# Altium schematic sheet Sheet1.SchDoc
size A
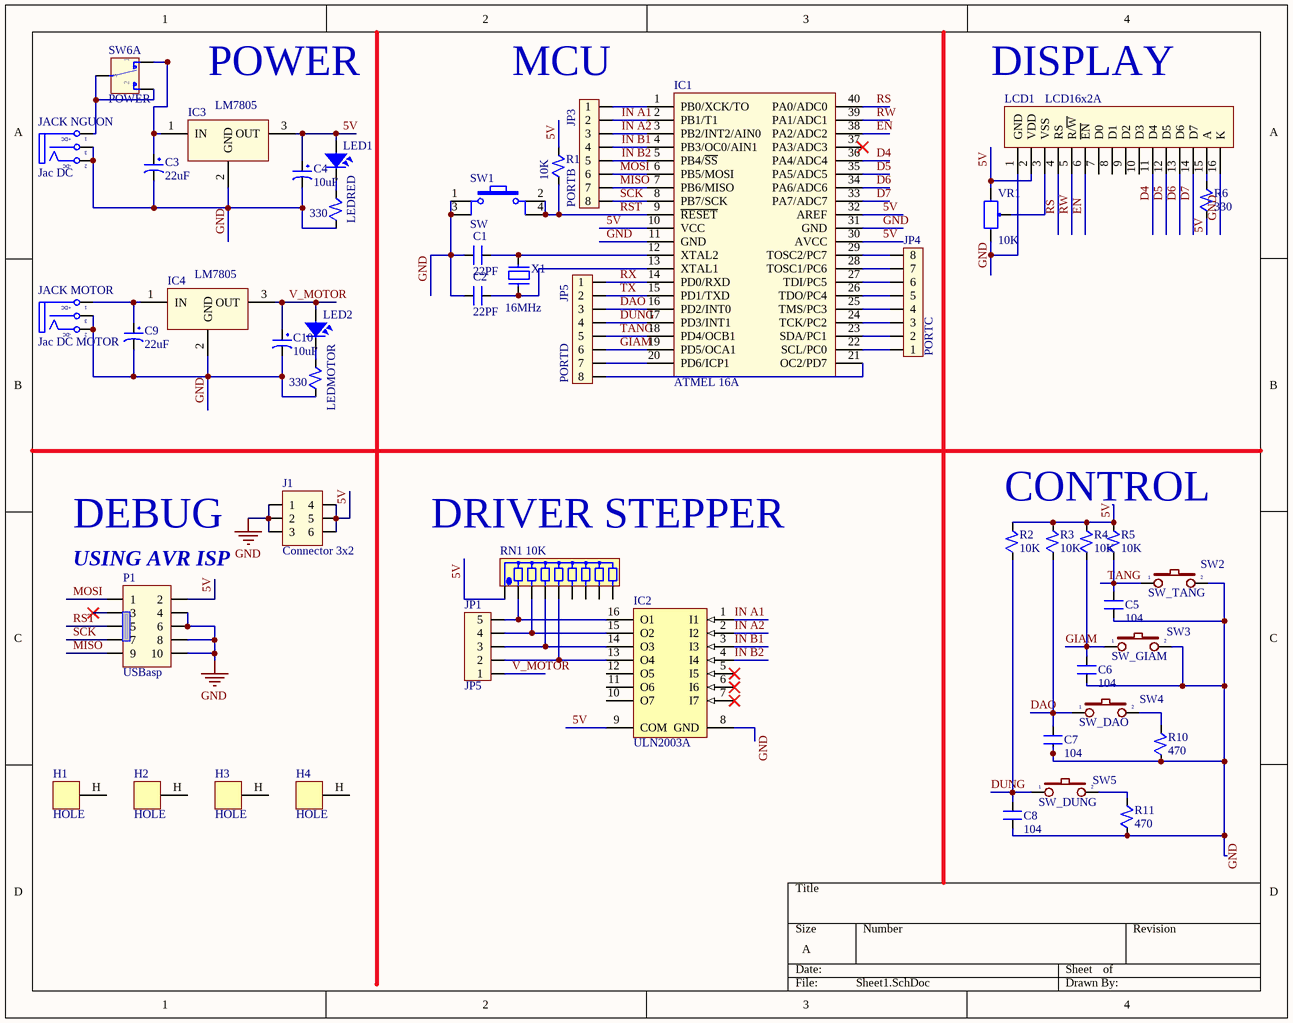
[diagram p0: Sheet1.SchDoc]

## Parts
C1  22PF  [SM-0805]
C2  22PF  [SM-0805]
C3  22uF  [CP1/2]
C4  10uF  [CP1/2]
C5  104  [SM-0805]
C6  104  [SM-0805]
C7  104  [SM-0805]
C8  104  [SM-0805]
C9  22uF  [CP1/2]
C10  10uF  [CP1/2]
H1  HOLE  [HOLE]
H2  HOLE  [HOLE]
H3  HOLE  [HOLE]
H4  HOLE  [HOLE]
IC1  ATMEL 16A  [DIP40/W0.6]
IC2  ULN2003A  [DIP16/W0.3]
IC3  LM7805  [QTO-220]
IC4  LM7805  [QTO-220]
J1  Connector 3x2  [JP3x2]
JACK_MOTOR  Jac DC MOTOR  [DC-IN]
JACK_NGUON  Jac DC  [DC-IN]
JP1  JP5  [CON5]
JP3  PORTB  [JP_CAI_8]
JP4  PORTC  [JP_CAI_8]
JP5  PORTD  [JP_CAI_8]
LCD1  LCD16x2A  [LCD16X2N]
LED1  LEDRED  [led5mm_yellow]
LED2  LEDMOTOR  [led5mm_yellow]
P1  USBasp  [IDE_2X5]
R1  10K  [RES_0805]
R2  10K  [RES_0805]
R3  10K  [RES_0805]
R4  10K  [RES_0805]
R5  10K  [RES_0805]
R6  330  [RES_0805]
R7  330  [RES_0805]
R10  470  [RES_0805]
R11  470  [RES_0805]
R12  330  [RES_0805]
RN1  10K  [RN8]
SW1  SW  [SW4]
SW2  SW_TANG  [SW2]
SW3  SW_GIAM  [SW2]
SW4  SW_DAO  [SW2]
SW5  SW_DUNG  [SW2]
SW6  POWER  [SW6]  (part A of 2)
VR1  10K  [VR]
X1  16MHz  [XT2]

## Nets
GND: C1.1 C2.1 C3.2 C4.2 C5.2 C6.2 C7.2 C8.2 C9.2 C10.2 IC1.11(GND) IC1.31(GND) IC2.8(GND) IC3.2(GND) IC4.2(GND) J1.1 J1.2 J1.3 JACK_MOTOR.2(TN) JACK_MOTOR.3(S) JACK_NGUON.2(TN) JACK_NGUON.3(S) LCD1.1(GND) LCD1.16(K) P1.4 P1.6 P1.8 P1.10 R7.1 R10.1 R11.1 R12.1 SW1.1 SW1.3 SW2.2 SW3.2 VR1.3
5V: C4.1 IC1.10(VCC) IC1.30(AVCC) IC1.32(AREF) IC2.9(COM) IC3.3(OUT) J1.4 J1.5 J1.6 LCD1.2(VDD) LED1.1 P1.2 R1.2 R2.2 R3.2 R4.2 R5.2 R6.1 RN1.1 VR1.1
D4: IC1.36(PA4/ADC4) LCD1.11(D4)
D5: IC1.35(PA5/ADC5) LCD1.12(D5)
D6: IC1.34(PA6/ADC6) LCD1.13(D6)
D7: IC1.33(PA7/ADC7) LCD1.14(D7)
DAO: C7.1 IC1.16(PD2/INT0) JP5.3 R3.1 SW4.1
DUNG: C8.1 IC1.17(PD3/INT1) JP5.4 R2.1 SW5.1
EN: IC1.38(PA2/ADC2) LCD1.6(~{EN})
GIAM: C6.1 IC1.19(PD5/OCA1) JP5.6 R4.1 SW3.1
IN A1: IC1.2(PB1/T1) IC2.1(I1) JP3.2
IN A2: IC1.3(PB2/INT2/AIN0) IC2.2(I2) JP3.3
IN B1: IC1.4(PB3/OC0/AIN1) IC2.3(I3) JP3.4
IN B2: IC1.5(PB4/~{SS}) IC2.4(I4) JP3.5
MISO: IC1.7(PB6/MISO) JP3.7 P1.9
MOSI: IC1.6(PB5/MOSI) JP3.6 P1.1
RS: IC1.40(PA0/ADC0) LCD1.4(RS)
RST: IC1.9(~{RESET}) P1.5 R1.1 SW1.2 SW1.4
RW: IC1.39(PA1/ADC1) LCD1.5(R/~{W})
RX: IC1.14(PD0/RXD) JP5.1
SCK: IC1.8(PB7/SCK) JP3.8 P1.7
TANG: C5.1 IC1.18(PD4/OCB1) JP5.5 R5.1 SW2.1
TX: IC1.15(PD1/TXD) JP5.2
V_MOTOR: C10.1 IC4.3(OUT) JP1.1 LED2.1
NetC1_2: C1.2 IC1.12(XTAL2) X1.2
NetC2_2: C2.2 IC1.13(XTAL1) X1.1
NetC3_1: C3.1 IC3.1(IN) SW6.1
NetC9_1: C9.1 IC4.1(IN) JACK_MOTOR.1(T)
NetIC1_1: IC1.1(PB0/XCK/TO) JP3.1
NetIC1_20: IC1.20(PD6/ICP1) JP5.7
NetIC1_21: IC1.21(OC2/PD7) JP5.8
NetIC1_22: IC1.22(SCL/PC0) JP4.1
NetIC1_23: IC1.23(SDA/PC1) JP4.2
NetIC1_24: IC1.24(TCK/PC2) JP4.3
NetIC1_25: IC1.25(TMS/PC3) JP4.4
NetIC1_26: IC1.26(TDO/PC4) JP4.5
NetIC1_27: IC1.27(TDI/PC5) JP4.6
NetIC1_28: IC1.28(TOSC1/PC6) JP4.7
NetIC1_29: IC1.29(TOSC2/PC7) JP4.8
NetIC2_13: IC2.13(O4) JP1.2 RN1.5
NetIC2_14: IC2.14(O3) JP1.3 RN1.4
NetIC2_15: IC2.15(O2) JP1.4 RN1.3
NetIC2_16: IC2.16(O1) JP1.5 RN1.2
NetJACK_NGUON_1: JACK_NGUON.1(T) SW6.2 SW6.3
NetLCD1_3: LCD1.3(VSS) VR1.2
NetLCD1_15: LCD1.15(A) R6.2
NetLED1_2: LED1.2 R7.2
NetLED2_2: LED2.2 R12.2
NetR10_2: R10.2 SW4.2
NetR11_2: R11.2 SW5.2

Not connected (* = marked no-connect by the designer): H1 H(HOLE); H2 H(HOLE); H3 H(HOLE); H4 H(HOLE); IC1 37(PA3/ADC3)*; IC2 5(I5)* 6(I6)* 7(I7)* 10(O7) 11(O6) 12(O5); LCD1 7(D0) 8(D1) 9(D2) 10(D3); P1 3*; RN1 6 7 8 9

## Notes on the sheet
- POWER
- (near JP3) MCU
- DISPLAY
- CONTROL
- DEBUG
- (near P1) USING AVR ISP
- (near RN1) DRIVER STEPPER
- (in symbol DCIN) +DC; -DC

## Library data of the parts
C1 C2 C5-C8 = CM: Cap SMD; Value: 103
C3 C4 C9 C10 = CP1: Cap P  0,1uF < 22uF , 16 - 50V; Value: 10uF/50V; Description 1: 10 => 220uF/6,3V/10V - 10uF => 100uF/16V; Description 2: 0,1uF => 33uF/50V - 10uF => 22uF/63V; Description 3: 0,47uF => 10uF/100V
IC1 = Atmega16L: 8-Bit AVR Microcontroller with 16K Bytes of In-System Programmable Flash Memory; Value: Atmega 16L
IC2 = ULN2003A: High-Voltage, High-Current Darlington Array; LatestRevisionNote: Stylized 3D Model Added.; Publisher: Altium Limited; Value: ULN2003A
IC3 IC4 = LM78xx: On ap +, from + 5 to + 24VDC; Value: LM7805
J1 = JP3x2: Value: Connector 3x2
JACK_MOTOR = DCIN: Jac DC input; Value: Jac DC
JACK_NGUON = DCIN: Jac DC input; Value: Jac DC
JP1 = Con5: Connector 5; Value: Connector 5
JP3-JP5 = JP8: JP8 PIN; Value: JP7
LCD1 = LCD16x2: LCD dipslay 16 char, 2 line; Value: LCD16x2A
LED1 LED2 = LED: LED Single colour Green and Red; Value: LED 3 ly Single Colour
P1 = IDE 5x2: Header 5x2; Value: Header 5x2
R1-R7 R10-R12 = RES_0805: res_dan
RN1 = RN8: Resistor 8 (Thanh); Value: Tro thanh 10K
SW1 = SW4: Switch button 4 pin; Value: Button chip 4 pin
SW2-SW5 = SW2: Switch button 2 pin; Value: SW chip 2 pin
SW6 = SW6A: SW-DTDP - 6 Pin; Value: SW6
VR1 = VR: Var Resistor; Value: VR 10K
X1 = XT2: Crystal For all Crystal 2pin.; Value: 4Mhz